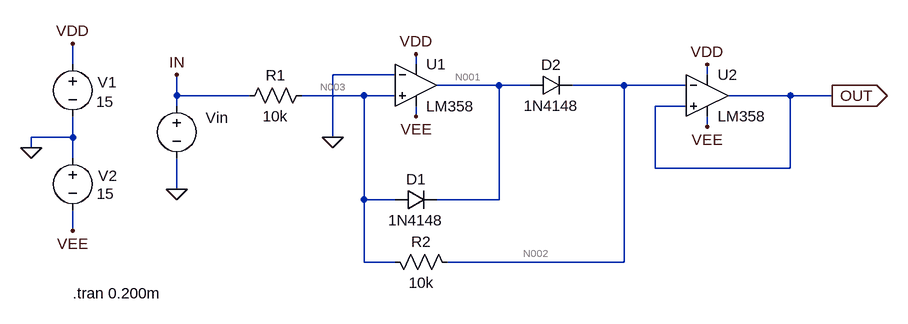
[diagram p0: schematic v1.1.asc]
v1.1.asc, the LTspice schematic file:
Version 4.1
SHEET 1 2124 700
WIRE 576 -1184 576 -1216
WIRE 1104 -1184 1104 -1200
WIRE 1072 -1168 976 -1168
WIRE 1552 -1168 1552 -1184
WIRE 1232 -1152 1136 -1152
WIRE 1280 -1152 1232 -1152
WIRE 1424 -1152 1344 -1152
WIRE 1520 -1152 1424 -1152
WIRE 736 -1136 736 -1168
WIRE 848 -1136 736 -1136
WIRE 1024 -1136 928 -1136
WIRE 1072 -1136 1024 -1136
WIRE 1680 -1136 1584 -1136
WIRE 1744 -1136 1680 -1136
WIRE 736 -1120 736 -1136
WIRE 1520 -1120 1472 -1120
WIRE 1104 -1104 1104 -1120
WIRE 1552 -1088 1552 -1104
WIRE 576 -1072 576 -1104
WIRE 576 -1072 512 -1072
WIRE 976 -1072 976 -1168
WIRE 512 -1056 512 -1072
WIRE 576 -1040 576 -1072
WIRE 1472 -1024 1472 -1120
WIRE 1680 -1024 1680 -1136
WIRE 1680 -1024 1472 -1024
WIRE 736 -992 736 -1040
WIRE 1024 -976 1024 -1136
WIRE 1072 -976 1024 -976
WIRE 1232 -976 1232 -1152
WIRE 1232 -976 1136 -976
WIRE 576 -928 576 -960
WIRE 1024 -880 1024 -976
WIRE 1072 -880 1024 -880
WIRE 1424 -880 1424 -1152
WIRE 1424 -880 1152 -880
FLAG 576 -1216 VDD
FLAG 512 -1056 0
FLAG 1744 -1136 OUT
IOPIN 1744 -1136 Out
FLAG 1104 -1104 VEE
FLAG 576 -928 VEE
FLAG 1104 -1200 VDD
FLAG 736 -992 0
FLAG 1552 -1088 VEE
FLAG 1552 -1184 VDD
FLAG 736 -1168 IN
FLAG 976 -1072 0
SYMBOL voltage 576 -1200 R0
WINDOW 123 0 0 Left 2
WINDOW 39 0 0 Left 2
WINDOW 0 38 43 Left 2
WINDOW 3 36 73 Left 2
SYMATTR InstName V1
SYMATTR Value 15
SYMBOL voltage 736 -1136 M0
WINDOW 123 24 146 Left 2
WINDOW 39 24 125 Left 2
WINDOW 0 -79 34 Left 2
WINDOW 3 -256 58 Invisible 2
SYMATTR InstName Vin
SYMATTR Value SINE(0V 5V 10KH)
SYMBOL voltage 576 -1056 R0
WINDOW 123 24 146 Left 2
WINDOW 39 24 125 Left 2
WINDOW 0 39 43 Left 2
WINDOW 3 37 71 Left 2
SYMATTR InstName V2
SYMATTR Value 15
SYMBOL MyLib\\OpAmp\\LM358 1104 -1216 R0
SYMATTR InstName U1
SYMBOL MyLib\\OpAmp\\LM358 1552 -1200 R0
SYMATTR InstName U2
SYMBOL diode 1072 -960 R270
WINDOW 0 32 32 VTop 2
WINDOW 3 0 32 VBottom 2
SYMATTR InstName D1
SYMATTR Value 1N4148
SYMBOL res 944 -1152 R90
WINDOW 0 0 56 VBottom 2
WINDOW 3 32 56 VTop 2
SYMATTR InstName R1
SYMATTR Value 10k
SYMBOL res 1168 -864 M270
WINDOW 0 32 56 VTop 2
WINDOW 3 0 56 VBottom 2
SYMATTR InstName R2
SYMATTR Value 10k
SYMBOL diode 1280 -1136 R270
WINDOW 0 32 32 VTop 2
WINDOW 3 0 32 VBottom 2
SYMATTR InstName D2
SYMATTR Value 1N4148
TEXT 576 -832 Left 2 !.tran 0.200m

The netlist it stands for:
* v1.1.asc
V1 VDD 0 15
Vin IN 0 SINE(0V 5V 10KH)
V2 0 VEE 15
* U1: LM358 (symbol MyLib\OpAmp\LM358 not available, pins judged from their places): In+=N003 In-=0 V+=VDD V-=VEE OUT=N001
* U2: LM358 (symbol MyLib\OpAmp\LM358 not available, pins judged from their places): In+=OUT In-=N002 V+=VDD V-=VEE OUT=OUT
D1 N003 N001 1N4148
R1 N003 IN 10k
R2 N002 N003 10k
D2 N001 N002 1N4148
.model D D
.lib standard.dio
.tran 0.200m
.backanno
.end

* Results of the author's LTspice run, read from the files saved beside the schematic
* Operating Point, zero values left out:
*   V(n001) = -94.36 mV
*   V(n002) = 78.87 µV
*   V(n003) = 938.4 nV
*   V(out) = 78.87 µV
*   V(vdd) = 15 V
*   V(vee) = -15 V
*   I(D1) = 17.7 nA
*   I(D2) = -2.207 nA
*   I(R1) = 93.84 pA
*   I(R2) = 7.793 nA
*   I(V1) = -688.2 µA
*   I(V2) = -688.2 µA
*   I(Vin) = 93.84 pA
*   Ix(u1:1) = -10 nA
*   Ix(u1:2) = -10 nA
*   Ix(u1:3) = 19.91 nA
*   Ix(u1:4) = 344.1 µA
*   Ix(u1:5) = -344.1 µA
*   Ix(u2:1) = -10 nA
*   Ix(u2:2) = -10 nA
*   Ix(u2:3) = 10 nA
*   Ix(u2:4) = 344.1 µA
*   Ix(u2:5) = -344.1 µA